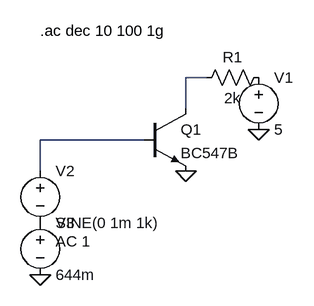
[diagram p0: schematic 1.p.asc]
1.p.asc, the LTspice schematic file:
Version 4.1
SHEET 1 880 680
WIRE 240 112 208 112
WIRE 208 160 208 112
WIRE 144 208 -16 208
WIRE -16 256 -16 208
FLAG -16 416 0
FLAG 320 192 0
FLAG 208 256 0
SYMBOL res 336 96 R90
WINDOW 0 0 56 VBottom 2
WINDOW 3 32 56 VTop 2
SYMATTR InstName R1
SYMATTR Value 2k
SYMBOL voltage 320 96 R0
SYMATTR InstName V1
SYMATTR Value 5
SYMBOL voltage -16 240 R0
WINDOW 123 24 124 Left 2
WINDOW 39 0 0 Left 0
SYMATTR InstName V2
SYMATTR Value SINE(0 1m 1k)
SYMATTR Value2 AC 1
SYMBOL voltage -16 320 R0
SYMATTR InstName V3
SYMATTR Value 644m
SYMBOL npn 144 160 R0
SYMATTR InstName Q1
SYMATTR Value BC547B
TEXT -16 40 Left 2 !.ac dec 10 100 1g

The netlist it stands for:
* 1.p.asc
R1 P001 N001 2k
V1 P001 0 5
V2 N002 P002 SINE(0 1m 1k) AC 1
V3 P002 0 644m
Q1 N001 N002 0 0 BC547B
.model NPN NPN
.model PNP PNP
.lib standard.bjt
.ac dec 10 100 1g
.backanno
.end